# Altium schematic sheet TopV4.SchDoc
size B; Organization: Cornell University; DocumentNumber: 1 of 11; SheetNumber: 1; SheetTotal: 11; DocumentName: Top Sheet; ProjectName: OAAN
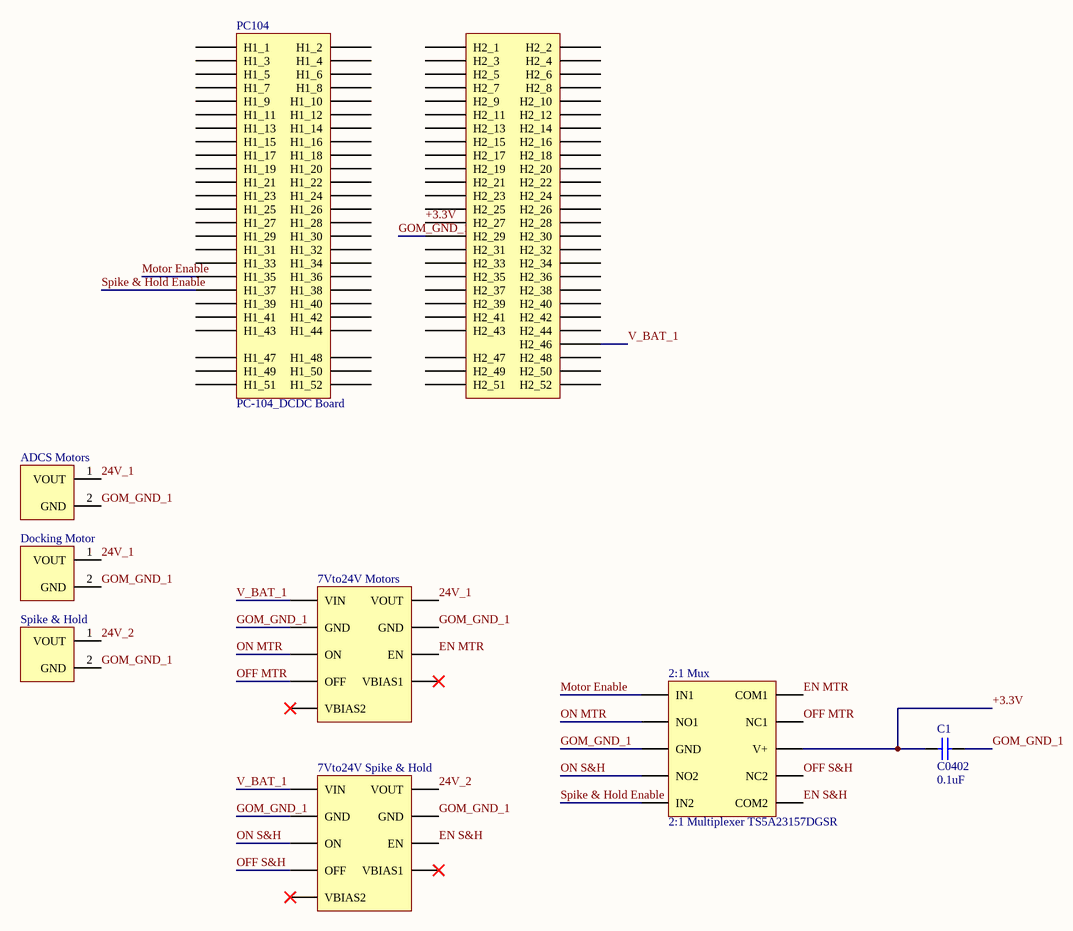
[diagram p0: TopV4.SchDoc]

## Parts
2:1_Mux  2:1 Multiplexer TS5A23157DGSR  [2:1 Mux]
7Vto24V_Motors  7Vto24V  [7Vto24V]  (value not drawn)
7Vto24V_Spike_&_Hold  7Vto24V  [7Vto24V]  (value not drawn)
ADCS_Motors  HighVoltageHeader  [Header]  (value not drawn)
C1  C0402  value 0.1uF  [0402]
Docking_Motor  HighVoltageHeader  [Header]  (value not drawn)
PC104  PC-104_DCDC Board  [PC-104FOOTPRINT DCDC]
Spike_&_Hold  HighVoltageHeader  [Header]  (value not drawn)

## Nets
24V_1: 7Vto24V_Motors.3(VOUT) ADCS_Motors.1(VOUT) Docking_Motor.1(VOUT)
24V_2: 7Vto24V_Spike_&_Hold.3(VOUT) Spike_&_Hold.1(VOUT)
+3.3V: 2:1_Mux.8(V+) C1.1 PC104.H2_27
EN MTR: 2:1_Mux.10(COM1) 7Vto24V_Motors.6(EN)
EN S&H: 2:1_Mux.6(COM2) 7Vto24V_Spike_&_Hold.6(EN)
GOM_GND_1: 2:1_Mux.3(GND) 7Vto24V_Motors.1(GND) 7Vto24V_Motors.4(GND) 7Vto24V_Spike_&_Hold.1(GND) 7Vto24V_Spike_&_Hold.4(GND) ADCS_Motors.2(GND) C1.2 Docking_Motor.2(GND) PC104.H2_29 Spike_&_Hold.2(GND)
Motor Enable: 2:1_Mux.1(IN1) PC104.H1_35
OFF MTR: 2:1_Mux.9(NC1) 7Vto24V_Motors.7(OFF)
OFF S&H: 2:1_Mux.7(NC2) 7Vto24V_Spike_&_Hold.7(OFF)
ON MTR: 2:1_Mux.2(NO1) 7Vto24V_Motors.5(ON)
ON S&H: 2:1_Mux.4(NO2) 7Vto24V_Spike_&_Hold.5(ON)
Spike & Hold Enable: 2:1_Mux.5(IN2) PC104.H1_37
V_BAT_1: 7Vto24V_Motors.2(VIN) 7Vto24V_Spike_&_Hold.2(VIN) PC104.H2_46

Not connected (* = marked no-connect by the designer): 7Vto24V_Motors 8(VBIAS1)* 9(VBIAS2)*; 7Vto24V_Spike_&_Hold 8(VBIAS1)* 9(VBIAS2)*; PC104 H1_1 H1_2 H1_3 H1_4 H1_5 H1_6 H1_7 H1_8 H1_9 H1_10 H1_11 H1_12 H1_13 H1_14 H1_15 H1_16 H1_17 H1_18 H1_19 H1_20 H1_21 H1_22 H1_23 H1_24 H1_25 H1_26 H1_27 H1_28 H1_29 H1_30 H1_31 H1_32 H1_33 H1_34 H1_36 H1_38 H1_39 H1_40 H1_41 H1_42 H1_43 H1_44 H1_47 H1_48 H1_49 H1_50 H1_51 H1_52 H2_1 H2_2 H2_3 H2_4 H2_5 H2_6 H2_7 H2_8 H2_9 H2_10 H2_11 H2_12 H2_13 H2_14 H2_15 H2_16 H2_17 H2_18 H2_19 H2_20 H2_21 H2_22 H2_23 H2_24 H2_25 H2_26 H2_28 H2_30 H2_31 H2_32 H2_33 H2_34 H2_35 H2_36 H2_37 H2_38 H2_39 H2_40 H2_41 H2_42 H2_43 H2_44 H2_47 H2_48 H2_49 H2_50 H2_51 H2_52

## Library data of the parts
C1 = C0402: Ceramic Chip Capacitor - Standard; Note: Footprint corresponds to dimensions for bulk cassette packaging. This case size has tightened tolerances.; Published: 17-Jul-2002; LatestRevisionDate: 19-Mar-2004; LatestRevisionNote: Silkscreen size reduced.; DatasheetDocument: Mar-2001; PackageDocument: Mar-2001; PackageReference: 0402; Publisher: Altium Limited; Code_JEITA: 0402; Code_IPC: 1005 [0402]; ComponentLink1Description: Manufacturer Link; ComponentLink1URL: http://www.kemet.com/; ComponentLink2Description: Datasheet; ComponentLink2URL: http://www.kemet.com/kemet/web/homepage/kechome.nsf/vapubfilesname/F3102TA.pdf/$file/F3102TA.pdf